# Altium schematic sheet Prom21Core.SchDoc
size 566 x 320 mm; SheetNumber: 3; SheetTotal: 6
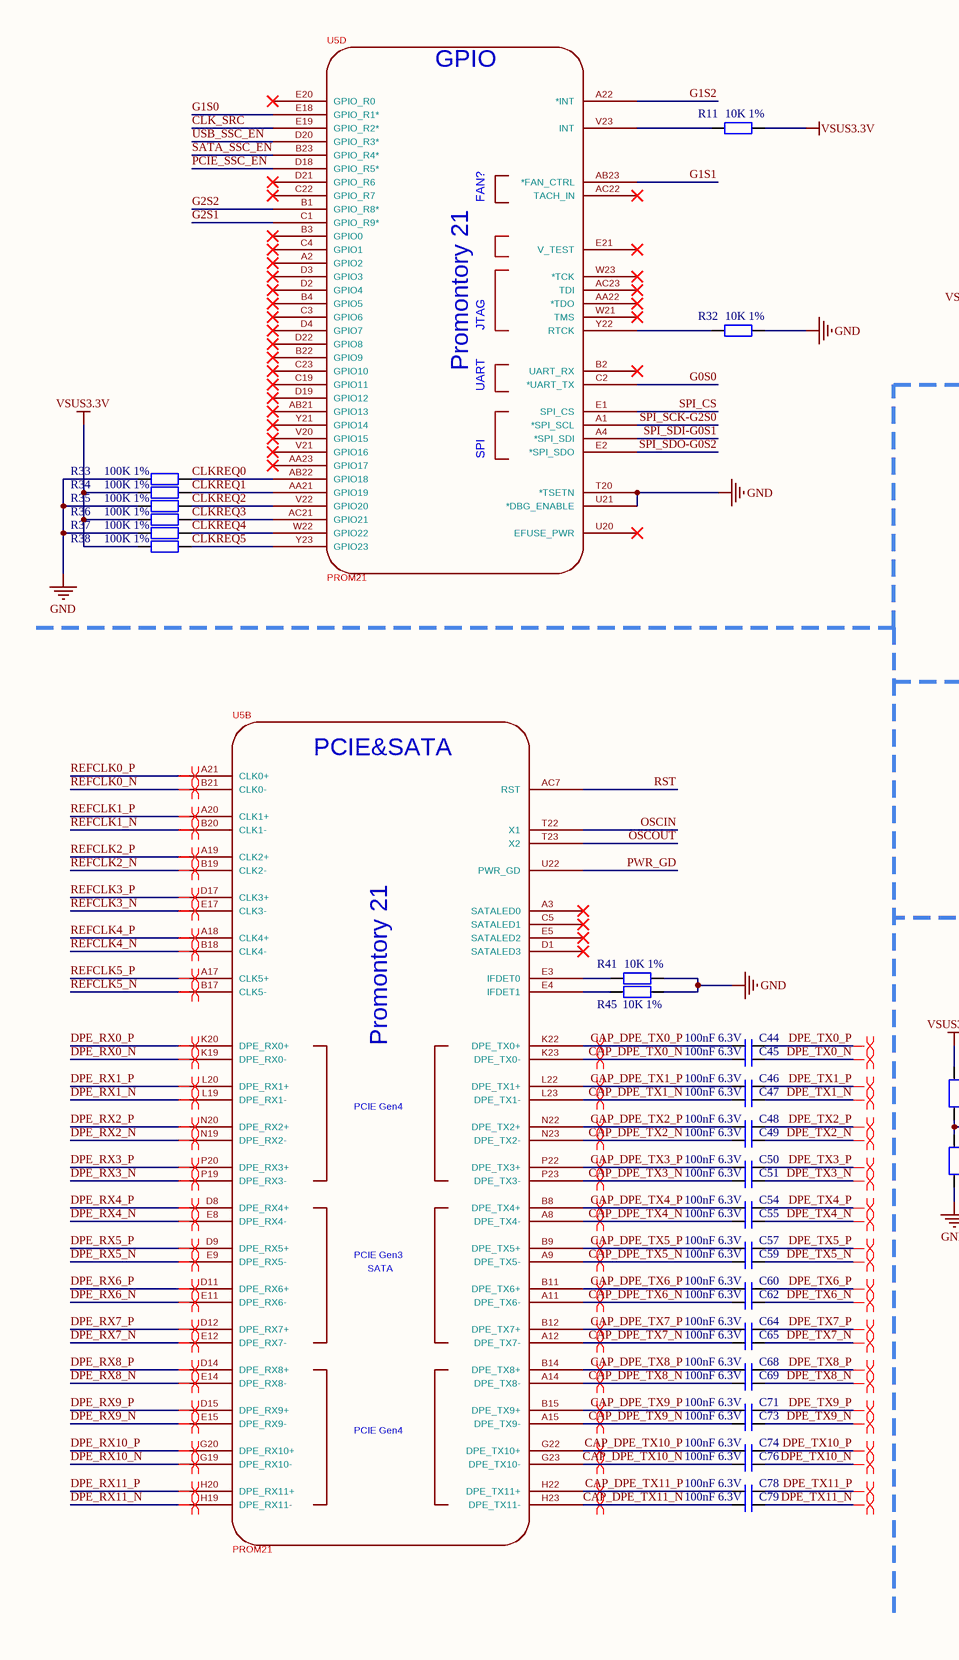
[diagram p0: Prom21Core.SchDoc, left]
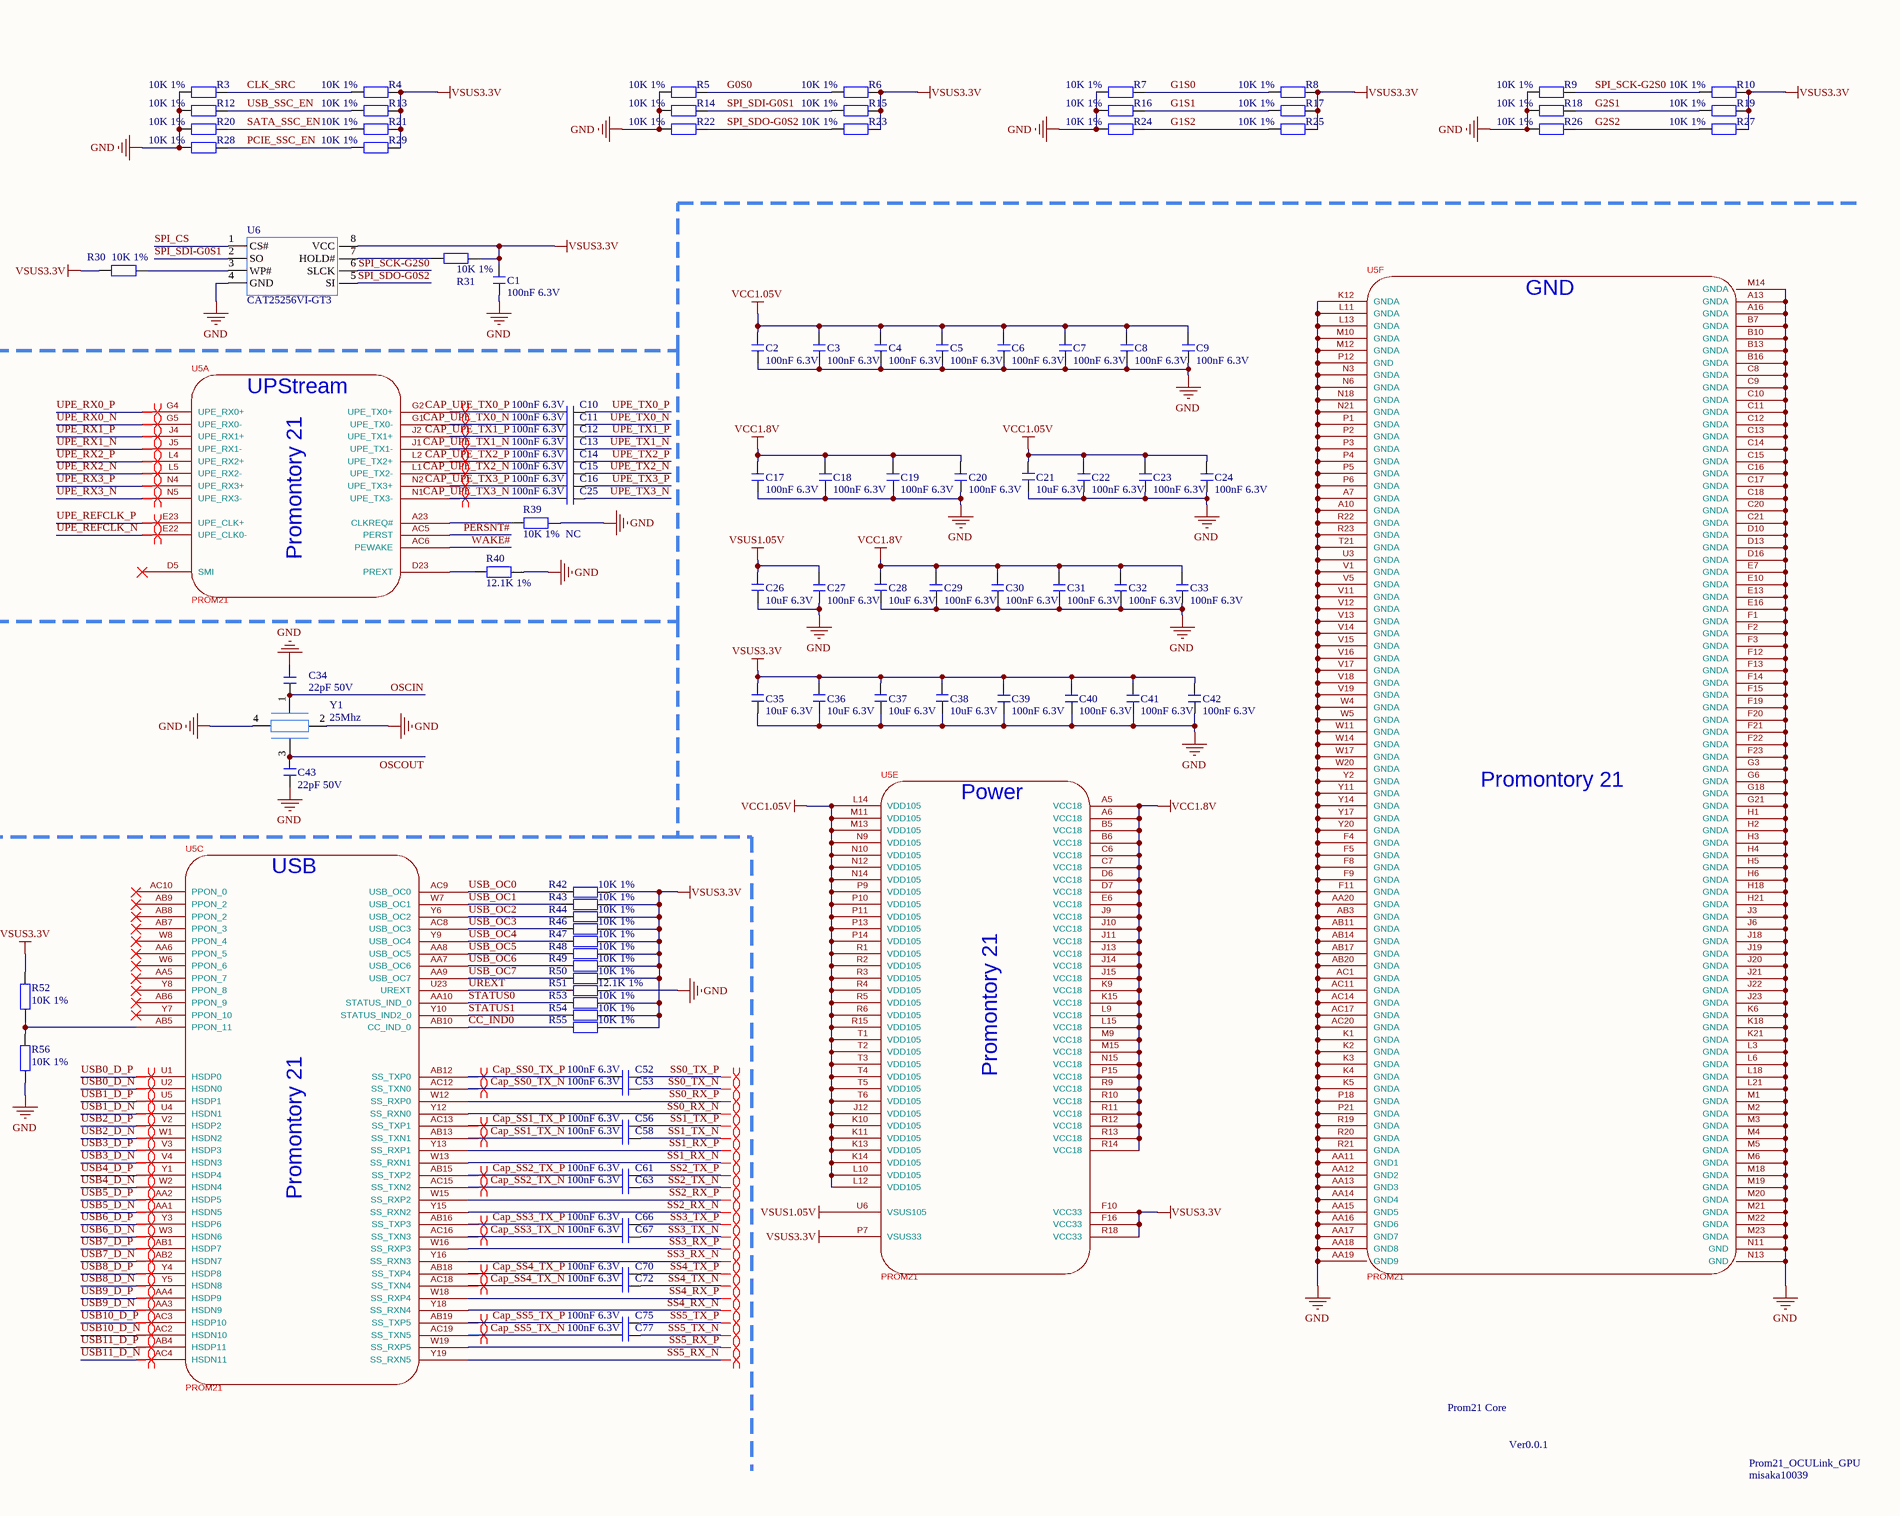
[diagram p1: Prom21Core.SchDoc, right]

## Parts
C1  100nF 6.3V  [C0402_L]
C2  100nF 6.3V  [C0402_L]
C3  100nF 6.3V  [C0402_L]
C4  100nF 6.3V  [C0402_L]
C5  100nF 6.3V  [C0402_L]
C6  100nF 6.3V  [C0402_L]
C7  100nF 6.3V  [C0402_L]
C8  100nF 6.3V  [C0402_L]
C9  100nF 6.3V  [C0402_L]
C10  100nF 6.3V  [C0402_L]
C11  100nF 6.3V  [C0402_L]
C12  100nF 6.3V  [C0402_L]
C13  100nF 6.3V  [C0402_L]
C14  100nF 6.3V  [C0402_L]
C15  100nF 6.3V  [C0402_L]
C16  100nF 6.3V  [C0402_L]
C17  100nF 6.3V  [C0402_L]
C18  100nF 6.3V  [C0402_L]
C19  100nF 6.3V  [C0402_L]
C20  100nF 6.3V  [C0402_L]
C21  10uF 6.3V  [C0603_L]
C22  100nF 6.3V  [C0402_L]
C23  100nF 6.3V  [C0402_L]
C24  100nF 6.3V  [C0402_L]
C25  100nF 6.3V  [C0402_L]
C26  10uF 6.3V  [C0603_L]
C27  100nF 6.3V  [C0402_L]
C28  10uF 6.3V  [C0603_L]
C29  100nF 6.3V  [C0402_L]
C30  100nF 6.3V  [C0402_L]
C31  100nF 6.3V  [C0402_L]
C32  100nF 6.3V  [C0402_L]
C33  100nF 6.3V  [C0402_L]
C34  22pF 50V  [C0402_L]
C35  10uF 6.3V  [C0603_L]
C36  10uF 6.3V  [C0603_L]
C37  10uF 6.3V  [C0603_L]
C38  10uF 6.3V  [C0603_L]
C39  100nF 6.3V  [C0402_L]
C40  100nF 6.3V  [C0402_L]
C41  100nF 6.3V  [C0402_L]
C42  100nF 6.3V  [C0402_L]
C43  22pF 50V  [C0402_L]
C44  100nF 6.3V  [C0402_L]
C45  100nF 6.3V  [C0402_L]
C46  100nF 6.3V  [C0402_L]
C47  100nF 6.3V  [C0402_L]
C48  100nF 6.3V  [C0402_L]
C49  100nF 6.3V  [C0402_L]
C50  100nF 6.3V  [C0402_L]
C51  100nF 6.3V  [C0402_L]
C52  100nF 6.3V  [C0402_L]
C53  100nF 6.3V  [C0402_L]
C54  100nF 6.3V  [C0402_L]
C55  100nF 6.3V  [C0402_L]
C56  100nF 6.3V  [C0402_L]
C57  100nF 6.3V  [C0402_L]
C58  100nF 6.3V  [C0402_L]
C59  100nF 6.3V  [C0402_L]
C60  100nF 6.3V  [C0402_L]
C61  100nF 6.3V  [C0402_L]
C62  100nF 6.3V  [C0402_L]
C63  100nF 6.3V  [C0402_L]
C64  100nF 6.3V  [C0402_L]
C65  100nF 6.3V  [C0402_L]
C66  100nF 6.3V  [C0402_L]
C67  100nF 6.3V  [C0402_L]
C68  100nF 6.3V  [C0402_L]
C69  100nF 6.3V  [C0402_L]
C70  100nF 6.3V  [C0402_L]
C71  100nF 6.3V  [C0402_L]
C72  100nF 6.3V  [C0402_L]
C73  100nF 6.3V  [C0402_L]
C74  100nF 6.3V  [C0402_L]
C75  100nF 6.3V  [C0402_L]
C76  100nF 6.3V  [C0402_L]
C77  100nF 6.3V  [C0402_L]
C78  100nF 6.3V  [C0402_L]
C79  100nF 6.3V  [C0402_L]
R3  10K 1%  [R0402_L]
R4  10K 1%  [R0402_L]
R5  10K 1%  [R0402_L]
R6  10K 1%  [R0402_L]
R7  10K 1%  [R0402_L]
R8  10K 1%  [R0402_L]
R9  10K 1%  [R0402_L]
R10  10K 1%  [R0402_L]
R11  10K 1%  [R0402_L]
R12  10K 1%  [R0402_L]
R13  10K 1%  [R0402_L]
R14  10K 1%  [R0402_L]
R15  10K 1%  [R0402_L]
R16  10K 1%  [R0402_L]
R17  10K 1%  [R0402_L]
R18  10K 1%  [R0402_L]
R19  10K 1%  [R0402_L]
R20  10K 1%  [R0402_L]
R21  10K 1%  [R0402_L]
R22  10K 1%  [R0402_L]
R23  10K 1%  [R0402_L]
R24  10K 1%  [R0402_L]
R25  10K 1%  [R0402_L]
R26  10K 1%  [R0402_L]
R27  10K 1%  [R0402_L]
R28  10K 1%  [R0402_L]
R29  10K 1%  [R0402_L]
R30  10K 1%  [R0402_L]
R31  10K 1%  [R0402_L]
R32  10K 1%  [R0402_L]
R33  100K 1%  [R0402_L]
R34  100K 1%  [R0402_L]
R35  100K 1%  [R0402_L]
R36  100K 1%  [R0402_L]
R37  100K 1%  [R0402_L]
R38  100K 1%  [R0402_L]
R39  10K 1%  NC  [R0402_L]
R40  12.1K 1%  [R0402_L]
R41  10K 1%  [R0402_L]
R42  10K 1%  [R0402_L]
R43  10K 1%  [R0402_L]
R44  10K 1%  [R0402_L]
R45  10K 1%  [R0402_L]
R46  10K 1%  [R0402_L]
R47  10K 1%  [R0402_L]
R48  10K 1%  [R0402_L]
R49  10K 1%  [R0402_L]
R50  10K 1%  [R0402_L]
R51  12.1K 1%  [R0402_L]
R52  10K 1%  [R0402_L]
R53  10K 1%  [R0402_L]
R54  10K 1%  [R0402_L]
R55  10K 1%  [R0402_L]
R56  10K 1%  [R0402_L]
U5  PROM21  [PROM21]  (parts A,B,C,D,E,F of 6)
U6  CAT25256VI-GT3  [SOP8_M]
Y1  25Mhz  [OSC-3225-4P]

## Nets
GND: C1.2 C2.2 C3.2 C4.2 C5.2 C6.2 C7.2 C8.2 C9.2 C17.2 C18.2 C19.2 C20.2 C21.1 C22.2 C23.2 C24.2 C26.1 C27.2 C28.1 C29.2 C30.2 C31.2 C32.2 C33.2 C34.1 C35.1 C36.1 C37.1 C38.1 C39.2 C40.2 C41.2 C42.2 C43.1 R3.1 R5.1 R7.1 R9.1 R12.1 R14.1 R16.1 R18.1 R20.1 R22.1 R24.1 R26.1 R28.1 R32.2 R33.1 R35.1 R37.1 R39.2 R40.2 R41.2 R45.2 R51.1 R56.1 U5.A7(GNDA) U5.A10(GNDA) U5.A13(GNDA) U5.A16(GNDA) U5.AA11(GND1) U5.AA12(GND2) U5.AA13(GND3) U5.AA14(GND4) U5.AA15(GND5) U5.AA16(GND6) U5.AA17(GND7) U5.AA18(GND8) U5.AA19(GND9) U5.AA20(GNDA) U5.AB3(GNDA) U5.AB11(GNDA) U5.AB14(GNDA) U5.AB17(GNDA) U5.AB20(GNDA) U5.AC1(GNDA) U5.AC11(GNDA) U5.AC14(GNDA) U5.AC17(GNDA) U5.AC20(GNDA) U5.B7(GNDA) U5.B10(GNDA) U5.B13(GNDA) U5.B16(GNDA) U5.C8(GNDA) U5.C9(GNDA) U5.C10(GNDA) U5.C11(GNDA) U5.C12(GNDA) U5.C13(GNDA) U5.C14(GNDA) U5.C15(GNDA) U5.C16(GNDA) U5.C17(GNDA) U5.C18(GNDA) U5.C20(GNDA) U5.C21(GNDA) U5.D10(GNDA) U5.D13(GNDA) U5.D16(GNDA) U5.E7(GNDA) U5.E10(GNDA) U5.E13(GNDA) U5.E16(GNDA) U5.F1(GNDA) U5.F2(GNDA) U5.F3(GNDA) U5.F4(GNDA) U5.F5(GNDA) U5.F8(GNDA) U5.F9(GNDA) U5.F11(GNDA) U5.F12(GNDA) U5.F13(GNDA) U5.F14(GNDA) U5.F15(GNDA) U5.F19(GNDA) U5.F20(GNDA) U5.F21(GNDA) U5.F22(GNDA) U5.F23(GNDA) U5.G3(GNDA) U5.G6(GNDA) U5.G18(GNDA) U5.G21(GNDA) U5.H1(GNDA) U5.H2(GNDA) U5.H3(GNDA) U5.H4(GNDA) U5.H5(GNDA) U5.H6(GNDA) U5.H18(GNDA) U5.H21(GNDA) U5.J3(GNDA) U5.J6(GNDA) U5.J18(GNDA) U5.J19(GNDA) U5.J20(GNDA) U5.J21(GNDA) U5.J22(GNDA) U5.J23(GNDA) U5.K1(GNDA) U5.K2(GNDA) U5.K3(GNDA) U5.K4(GNDA) U5.K5(GNDA) U5.K6(GNDA) U5.K12(GNDA) U5.K18(GNDA) U5.K21(GNDA) U5.L3(GNDA) U5.L6(GNDA) U5.L11(GNDA) U5.L13(GNDA) U5.L18(GNDA) U5.L21(GNDA) U5.M1(GNDA) U5.M2(GNDA) U5.M3(GNDA) U5.M4(GNDA) U5.M5(GNDA) U5.M6(GNDA) U5.M10(GNDA) U5.M12(GNDA) U5.M14(GNDA) U5.M18(GNDA) U5.M19(GNDA) U5.M20(GNDA) U5.M21(GNDA) U5.M22(GNDA) U5.M23(GNDA) U5.N3(GNDA) U5.N6(GNDA) U5.N11(GND) U5.N13(GND) U5.N18(GNDA) U5.N21(GNDA) U5.P1(GNDA) U5.P2(GNDA) U5.P3(GNDA) U5.P4(GNDA) U5.P5(GNDA) U5.P6(GNDA) U5.P12(GND) U5.P18(GNDA) U5.P21(GNDA) U5.R19(GNDA) U5.R20(GNDA) U5.R21(GNDA) U5.R22(GNDA) U5.R23(GNDA) U5.T20(*TSETN) U5.T21(GNDA) U5.U3(GNDA) U5.U21(*DBG_ENABLE) U5.V1(GNDA) U5.V5(GNDA) U5.V11(GNDA) U5.V12(GNDA) U5.V13(GNDA) U5.V14(GNDA) U5.V15(GNDA) U5.V16(GNDA) U5.V17(GNDA) U5.V18(GNDA) U5.V19(GNDA) U5.W4(GNDA) U5.W5(GNDA) U5.W11(GNDA) U5.W14(GNDA) U5.W17(GNDA) U5.W20(GNDA) U5.Y2(GNDA) U5.Y11(GNDA) U5.Y14(GNDA) U5.Y17(GNDA) U5.Y20(GNDA) U6.4(GND) Y1.2(GND) Y1.4(GND)
VCC1.05V: C2.1 C3.1 C4.1 C5.1 C6.1 C7.1 C8.1 C9.1 C21.2 C22.1 C23.1 C24.1 U5.J12(VDD105) U5.K10(VDD105) U5.K11(VDD105) U5.K13(VDD105) U5.K14(VDD105) U5.L10(VDD105) U5.L12(VDD105) U5.L14(VDD105) U5.M11(VDD105) U5.M13(VDD105) U5.N9(VDD105) U5.N10(VDD105) U5.N12(VDD105) U5.N14(VDD105) U5.P9(VDD105) U5.P10(VDD105) U5.P11(VDD105) U5.P13(VDD105) U5.P14(VDD105) U5.R1(VDD105) U5.R2(VDD105) U5.R3(VDD105) U5.R4(VDD105) U5.R5(VDD105) U5.R6(VDD105) U5.R15(VDD105) U5.T1(VDD105) U5.T2(VDD105) U5.T3(VDD105) U5.T4(VDD105) U5.T5(VDD105) U5.T6(VDD105)
VCC1.8V: C17.1 C18.1 C19.1 C20.1 C28.2 C29.1 C30.1 C31.1 C32.1 C33.1 U5.A5(VCC18) U5.A6(VCC18) U5.B5(VCC18) U5.B6(VCC18) U5.C6(VCC18) U5.C7(VCC18) U5.D6(VCC18) U5.D7(VCC18) U5.E6(VCC18) U5.J9(VCC18) U5.J10(VCC18) U5.J11(VCC18) U5.J13(VCC18) U5.J14(VCC18) U5.J15(VCC18) U5.K9(VCC18) U5.K15(VCC18) U5.L9(VCC18) U5.L15(VCC18) U5.M9(VCC18) U5.M15(VCC18) U5.N15(VCC18) U5.P15(VCC18) U5.R9(VCC18) U5.R10(VCC18) U5.R11(VCC18) U5.R12(VCC18) U5.R13(VCC18) U5.R14(VCC18)
VSUS1.05V: C26.2 C27.1 U5.U6(VSUS105)
VSUS3.3V: C1.1 C35.2 C36.2 C37.2 C38.2 C39.1 C40.1 C41.1 C42.1 R4.2 R6.2 R8.2 R10.2 R11.2 R13.2 R15.2 R17.2 R19.2 R21.2 R23.2 R25.2 R27.2 R29.2 R30.1 R31.2 R34.1 R36.1 R38.1 R42.1 R43.1 R44.1 R46.1 R47.1 R48.1 R49.1 R50.1 R52.2 R53.1 R54.1 R55.1 U5.F10(VCC33) U5.F16(VCC33) U5.P7(VSUS33) U5.R18(VCC33) U6.8(VCC)
CAP_DPE_TX0_N: C45.2 U5.K23(DPE_TX0-)
CAP_DPE_TX0_P: C44.2 U5.K22(DPE_TX0+)
CAP_DPE_TX1_N: C47.2 U5.L23(DPE_TX1-)
CAP_DPE_TX1_P: C46.2 U5.L22(DPE_TX1+)
CAP_DPE_TX2_N: C49.2 U5.N23(DPE_TX2-)
CAP_DPE_TX2_P: C48.2 U5.N22(DPE_TX2+)
CAP_DPE_TX3_N: C51.2 U5.P23(DPE_TX3-)
CAP_DPE_TX3_P: C50.2 U5.P22(DPE_TX3+)
CAP_DPE_TX4_N: C55.2 U5.A8(DPE_TX4-)
CAP_DPE_TX4_P: C54.2 U5.B8(DPE_TX4+)
CAP_DPE_TX5_N: C59.2 U5.A9(DPE_TX5-)
CAP_DPE_TX5_P: C57.2 U5.B9(DPE_TX5+)
CAP_DPE_TX6_N: C62.2 U5.A11(DPE_TX6-)
CAP_DPE_TX6_P: C60.2 U5.B11(DPE_TX6+)
CAP_DPE_TX7_N: C65.2 U5.A12(DPE_TX7-)
CAP_DPE_TX7_P: C64.2 U5.B12(DPE_TX7+)
CAP_DPE_TX8_N: C69.2 U5.A14(DPE_TX8-)
CAP_DPE_TX8_P: C68.2 U5.B14(DPE_TX8+)
CAP_DPE_TX9_N: C73.2 U5.A15(DPE_TX9-)
CAP_DPE_TX9_P: C71.2 U5.B15(DPE_TX9+)
CAP_DPE_TX10_N: C76.2 U5.G23(DPE_TX10-)
CAP_DPE_TX10_P: C74.2 U5.G22(DPE_TX10+)
CAP_DPE_TX11_N: C79.2 U5.H23(DPE_TX11-)
CAP_DPE_TX11_P: C78.2 U5.H22(DPE_TX11+)
Cap_SS0_TX_N: C53.2 U5.AC12(SS_TXN0)
Cap_SS0_TX_P: C52.2 U5.AB12(SS_TXP0)
Cap_SS1_TX_N: C58.2 U5.AB13(SS_TXN1)
Cap_SS1_TX_P: C56.2 U5.AC13(SS_TXP1)
Cap_SS2_TX_N: C63.2 U5.AC15(SS_TXN2)
Cap_SS2_TX_P: C61.2 U5.AB15(SS_TXP2)
Cap_SS3_TX_N: C67.2 U5.AC16(SS_TXN3)
Cap_SS3_TX_P: C66.2 U5.AB16(SS_TXP3)
Cap_SS4_TX_N: C72.2 U5.AC18(SS_TXN4)
Cap_SS4_TX_P: C70.2 U5.AB18(SS_TXP4)
Cap_SS5_TX_N: C77.2 U5.AC19(SS_TXN5)
Cap_SS5_TX_P: C75.2 U5.AB19(SS_TXP5)
CAP_UPE_TX0_N: C11.2 U5.G1(UPE_TX0-)
CAP_UPE_TX0_P: C10.2 U5.G2(UPE_TX0+)
CAP_UPE_TX1_N: C13.2 U5.J1(UPE_TX1-)
CAP_UPE_TX1_P: C12.2 U5.J2(UPE_TX1+)
CAP_UPE_TX2_N: C15.2 U5.L1(UPE_TX2-)
CAP_UPE_TX2_P: C14.2 U5.L2(UPE_TX2+)
CAP_UPE_TX3_N: C25.2 U5.N1(UPE_TX3-)
CAP_UPE_TX3_P: C16.2 U5.N2(UPE_TX3+)
CC_IND0: R55.2 U5.AB10(CC_IND_0)
CLK_SRC: R3.2 R4.1 U5.E19(GPIO_R2*)
CLKREQ0: R33.2 U5.AB22(GPIO18)
CLKREQ1: R34.2 U5.AA21(GPIO19)
CLKREQ2: R35.2 U5.V22(GPIO20)
CLKREQ3: R36.2 U5.AC21(GPIO21)
CLKREQ4: R37.2 U5.W22(GPIO22)
CLKREQ5: R38.2 U5.Y23(GPIO23)
DPE_RX0_N: U5.K19(DPE_RX0-)
DPE_RX0_P: U5.K20(DPE_RX0+)
DPE_RX1_N: U5.L19(DPE_RX1-)
DPE_RX1_P: U5.L20(DPE_RX1+)
DPE_RX2_N: U5.N19(DPE_RX2-)
DPE_RX2_P: U5.N20(DPE_RX2+)
DPE_RX3_N: U5.P19(DPE_RX3-)
DPE_RX3_P: U5.P20(DPE_RX3+)
DPE_RX4_N: U5.E8(DPE_RX4-)
DPE_RX4_P: U5.D8(DPE_RX4+)
DPE_RX5_N: U5.E9(DPE_RX5-)
DPE_RX5_P: U5.D9(DPE_RX5+)
DPE_RX6_N: U5.E11(DPE_RX6-)
DPE_RX6_P: U5.D11(DPE_RX6+)
DPE_RX7_N: U5.E12(DPE_RX7-)
DPE_RX7_P: U5.D12(DPE_RX7+)
DPE_RX8_N: U5.E14(DPE_RX8-)
DPE_RX8_P: U5.D14(DPE_RX8+)
DPE_RX9_N: U5.E15(DPE_RX9-)
DPE_RX9_P: U5.D15(DPE_RX9+)
DPE_RX10_N: U5.G19(DPE_RX10-)
DPE_RX10_P: U5.G20(DPE_RX10+)
DPE_RX11_N: U5.H19(DPE_RX11-)
DPE_RX11_P: U5.H20(DPE_RX11+)
DPE_TX0_N: C45.1
DPE_TX0_P: C44.1
DPE_TX1_N: C47.1
DPE_TX1_P: C46.1
DPE_TX2_N: C49.1
DPE_TX2_P: C48.1
DPE_TX3_N: C51.1
DPE_TX3_P: C50.1
DPE_TX4_N: C55.1
DPE_TX4_P: C54.1
DPE_TX5_N: C59.1
DPE_TX5_P: C57.1
DPE_TX6_N: C62.1
DPE_TX6_P: C60.1
DPE_TX7_N: C65.1
DPE_TX7_P: C64.1
DPE_TX8_N: C69.1
DPE_TX8_P: C68.1
DPE_TX9_N: C73.1
DPE_TX9_P: C71.1
DPE_TX10_N: C76.1
DPE_TX10_P: C74.1
DPE_TX11_N: C79.1
DPE_TX11_P: C78.1
G0S0: R5.2 R6.1 U5.C2(*UART_TX)
G1S0: R7.2 R8.1 U5.E18(GPIO_R1*)
G1S1: R16.2 R17.1 U5.AB23(*FAN_CTRL)
G1S2: R24.2 R25.1 U5.A22(*INT)
G2S1: R18.2 R19.1 U5.C1(GPIO_R9*)
G2S2: R26.2 R27.1 U5.B1(GPIO_R8*)
OSCIN: C34.2 U5.T22(X1) Y1.1(XTAL_N)
OSCOUT: C43.2 U5.T23(X2) Y1.3(XTAL_P)
PCIE_SSC_EN: R28.2 R29.1 U5.D18(GPIO_R5*)
PERSNT#: U5.AC5(PERST)
PWR_GD: U5.U22(PWR_GD)
REFCLK0_N: U5.B21(CLK0-)
REFCLK0_P: U5.A21(CLK0+)
REFCLK1_N: U5.B20(CLK1-)
REFCLK1_P: U5.A20(CLK1+)
REFCLK2_N: U5.B19(CLK2-)
REFCLK2_P: U5.A19(CLK2+)
REFCLK3_N: U5.E17(CLK3-)
REFCLK3_P: U5.D17(CLK3+)
REFCLK4_N: U5.B18(CLK4-)
REFCLK4_P: U5.A18(CLK4+)
REFCLK5_N: U5.B17(CLK5-)
REFCLK5_P: U5.A17(CLK5+)
RST: U5.AC7(RST)
SATA_SSC_EN: R20.2 R21.1 U5.B23(GPIO_R4*)
SPI_CS: U5.E1(SPI_CS) U6.1(CS#)
SPI_SCK-G2S0: R9.2 R10.1 U5.A1(*SPI_SCL) U6.6(SLCK)
SPI_SDI-G0S1: R14.2 R15.1 U5.A4(*SPI_SDI) U6.2(SO)
SPI_SDO-G0S2: R22.2 R23.1 U5.E2(*SPI_SDO) U6.5(SI)
SS0_RX_N: U5.Y12(SS_RXN0)
SS0_RX_P: U5.W12(SS_RXP0)
SS0_TX_N: C53.1
SS0_TX_P: C52.1
SS1_RX_N: U5.W13(SS_RXN1)
SS1_RX_P: U5.Y13(SS_RXP1)
SS1_TX_N: C58.1
SS1_TX_P: C56.1
SS2_RX_N: U5.Y15(SS_RXN2)
SS2_RX_P: U5.W15(SS_RXP2)
SS2_TX_N: C63.1
SS2_TX_P: C61.1
SS3_RX_N: U5.Y16(SS_RXN3)
SS3_RX_P: U5.W16(SS_RXP3)
SS3_TX_N: C67.1
SS3_TX_P: C66.1
SS4_RX_N: U5.Y18(SS_RXN4)
SS4_RX_P: U5.W18(SS_RXP4)
SS4_TX_N: C72.1
SS4_TX_P: C70.1
SS5_RX_N: U5.Y19(SS_RXN5)
SS5_RX_P: U5.W19(SS_RXP5)
SS5_TX_N: C77.1
SS5_TX_P: C75.1
STATUS0: R53.2 U5.AA10(STATUS_IND_0)
STATUS1: R54.2 U5.Y10(STATUS_IND2_0)
UPE_REFCLK_N: U5.E22(UPE_CLK0-)
UPE_REFCLK_P: U5.E23(UPE_CLK+)
UPE_RX0_N: U5.G5(UPE_RX0-)
UPE_RX0_P: U5.G4(UPE_RX0+)
UPE_RX1_N: U5.J5(UPE_RX1-)
UPE_RX1_P: U5.J4(UPE_RX1+)
UPE_RX2_N: U5.L5(UPE_RX2-)
UPE_RX2_P: U5.L4(UPE_RX2+)
UPE_RX3_N: U5.N5(UPE_RX3-)
UPE_RX3_P: U5.N4(UPE_RX3+)
UPE_TX0_N: C11.1
UPE_TX0_P: C10.1
UPE_TX1_N: C13.1
UPE_TX1_P: C12.1
UPE_TX2_N: C15.1
UPE_TX2_P: C14.1
UPE_TX3_N: C25.1
UPE_TX3_P: C16.1
UREXT: R51.2 U5.U23(UREXT)
USB0_D_N: U5.U2(HSDN0)
USB0_D_P: U5.U1(HSDP0)
USB1_D_N: U5.U4(HSDN1)
USB1_D_P: U5.U5(HSDP1)
USB2_D_N: U5.W1(HSDN2)
USB2_D_P: U5.V2(HSDP2)
USB3_D_N: U5.V4(HSDN3)
USB3_D_P: U5.V3(HSDP3)
USB4_D_N: U5.W2(HSDN4)
USB4_D_P: U5.Y1(HSDP4)
USB5_D_N: U5.AA1(HSDN5)
USB5_D_P: U5.AA2(HSDP5)
USB6_D_N: U5.W3(HSDN6)
USB6_D_P: U5.Y3(HSDP6)
USB7_D_N: U5.AB2(HSDN7)
USB7_D_P: U5.AB1(HSDP7)
USB8_D_N: U5.Y5(HSDN8)
USB8_D_P: U5.Y4(HSDP8)
USB9_D_N: U5.AA3(HSDN9)
USB9_D_P: U5.AA4(HSDP9)
USB10_D_N: U5.AC2(HSDN10)
USB10_D_P: U5.AC3(HSDP10)
USB11_D_N: U5.AC4(HSDN11)
USB11_D_P: U5.AB4(HSDP11)
USB_OC0: R42.2 U5.AC9(USB_OC0)
USB_OC1: R43.2 U5.W7(USB_OC1)
USB_OC2: R44.2 U5.Y6(USB_OC2)
USB_OC3: R46.2 U5.AC8(USB_OC3)
USB_OC4: R47.2 U5.Y9(USB_OC4)
USB_OC5: R48.2 U5.AA8(USB_OC5)
USB_OC6: R49.2 U5.AA7(USB_OC6)
USB_OC7: R50.2 U5.AA9(USB_OC7)
USB_SSC_EN: R12.2 R13.1 U5.D20(GPIO_R3*)
WAKE#: U5.AC6(PEWAKE)
NetR11_1: R11.1 U5.V23(INT)
NetR30_2: R30.2 U6.3(WP#)
NetR31_1: R31.1 U6.7(HOLD#)
NetR32_1: R32.1 U5.Y22(RTCK)
NetR39_1: R39.1 U5.A23(CLKREQ#)
NetR40_1: R40.1 U5.D23(PREXT)
NetR41_1: R41.1 U5.E3(IFDET0)
NetR45_1: R45.1 U5.E4(IFDET1)
NetR52_1: R52.1 R56.2 U5.AB5(PPON_11)

Not connected (* = marked no-connect by the designer): U5 A2(GPIO2)* A3(SATALED0)* AA5(PPON_7)* AA6(PPON_5)* AA22(*TDO)* AA23(GPIO17)* AB6(PPON_9)* AB7(PPON_3)* AB8(PPON_2)* AB9(PPON_2)* AB21(GPIO13)* AC10(PPON_0)* AC22(TACH_IN)* AC23(TDI)* B2(UART_RX)* B3(GPIO0)* B4(GPIO5)* B22(GPIO9)* C3(GPIO6)* C4(GPIO1)* C5(SATALED1)* C19(GPIO11)* C22(GPIO_R7)* C23(GPIO10)* D1(SATALED3)* D2(GPIO4)* D3(GPIO3)* D4(GPIO7)* D5(SMI)* D19(GPIO12)* D21(GPIO_R6)* D22(GPIO8)* E5(SATALED2)* E20(GPIO_R0)* E21(V_TEST)* U20(EFUSE_PWR)* V20(GPIO15)* V21(GPIO16)* W6(PPON_6)* W8(PPON_4)* W21(TMS)* W23(*TCK)* Y7(PPON_10)* Y8(PPON_8)* Y21(GPIO14)*

## Layout directives
differential pair: CAP_DPE_TX0_N, CAP_DPE_TX0_P, CAP_DPE_TX1_N, CAP_DPE_TX1_P, CAP_DPE_TX2_N, CAP_DPE_TX2_P, CAP_DPE_TX3_N, CAP_DPE_TX3_P, CAP_DPE_TX4_N, CAP_DPE_TX4_P, CAP_DPE_TX5_N, CAP_DPE_TX5_P, CAP_DPE_TX6_N, CAP_DPE_TX6_P, CAP_DPE_TX7_N, CAP_DPE_TX7_P, CAP_DPE_TX8_N, CAP_DPE_TX8_P, CAP_DPE_TX9_N, CAP_DPE_TX9_P, CAP_DPE_TX10_N, CAP_DPE_TX10_P, CAP_DPE_TX11_N, CAP_DPE_TX11_P, Cap_SS0_TX_N, Cap_SS0_TX_P, Cap_SS1_TX_N, Cap_SS1_TX_P, Cap_SS2_TX_N, Cap_SS2_TX_P, Cap_SS3_TX_N, Cap_SS3_TX_P, Cap_SS4_TX_N, Cap_SS4_TX_P, Cap_SS5_TX_N, Cap_SS5_TX_P, CAP_UPE_TX0_N, CAP_UPE_TX0_P, CAP_UPE_TX1_N, CAP_UPE_TX1_P, CAP_UPE_TX2_N, CAP_UPE_TX2_P, CAP_UPE_TX3_N, CAP_UPE_TX3_P, DPE_RX0_N, DPE_RX0_P, DPE_RX1_N, DPE_RX1_P, DPE_RX2_N, DPE_RX2_P, DPE_RX3_N, DPE_RX3_P, DPE_RX4_N, DPE_RX4_P, DPE_RX5_N, DPE_RX5_P, DPE_RX6_N, DPE_RX6_P, DPE_RX7_N, DPE_RX7_P, DPE_RX8_N, DPE_RX8_P, DPE_RX9_N, DPE_RX9_P, DPE_RX10_N, DPE_RX10_P, DPE_RX11_N, DPE_RX11_P, DPE_TX0_N, DPE_TX0_P, DPE_TX1_N, DPE_TX1_P, DPE_TX2_N, DPE_TX2_P, DPE_TX3_N, DPE_TX3_P, DPE_TX4_N, DPE_TX4_P, DPE_TX5_N, DPE_TX5_P, DPE_TX6_N, DPE_TX6_P, DPE_TX7_N, DPE_TX7_P, DPE_TX8_N, DPE_TX8_P, DPE_TX9_N, DPE_TX9_P, DPE_TX10_N, DPE_TX10_P, DPE_TX11_N, DPE_TX11_P, REFCLK0_N, REFCLK0_P, REFCLK1_N, REFCLK1_P, REFCLK2_N, REFCLK2_P, REFCLK3_N, REFCLK3_P, REFCLK4_N, REFCLK4_P, REFCLK5_N, REFCLK5_P, SS0_RX_N, SS0_RX_P, SS0_TX_N, SS0_TX_P, SS1_RX_N, SS1_RX_P, SS1_TX_N, SS1_TX_P, SS2_RX_N, SS2_RX_P, SS2_TX_N, SS2_TX_P, SS3_RX_N, SS3_RX_P, SS3_TX_N, SS3_TX_P, SS4_RX_N, SS4_RX_P, SS4_TX_N, SS4_TX_P, SS5_RX_N, SS5_RX_P, SS5_TX_N, SS5_TX_P, UPE_REFCLK_N, UPE_REFCLK_P, UPE_RX0_N, UPE_RX0_P, UPE_RX1_N, UPE_RX1_P, UPE_RX2_N, UPE_RX2_P, UPE_RX3_N, UPE_RX3_P, USB0_D_N, USB0_D_P, USB1_D_N, USB1_D_P, USB2_D_N, USB2_D_P, USB3_D_N, USB3_D_P, USB4_D_N, USB4_D_P, USB5_D_N, USB5_D_P, USB6_D_N, USB6_D_P, USB7_D_N, USB7_D_P, USB8_D_N, USB8_D_P, USB9_D_N, USB9_D_P, USB10_D_N, USB10_D_P, USB11_D_N, USB11_D_P

## Notes on the sheet
- Prom21 Core
- Ver0.0.1
- Prom21_OCULink_GPU
- misaka10039
- (in symbol PROM21, part A) UPStream; Promontory 21
- (in symbol PROM21, part B) PCIE&SATA; Promontory 21; PCIE Gen4; PCIE Gen3; SATA
- (in symbol PROM21, part C) USB; Promontory 21
- (in symbol PROM21, part D) GPIO; FAN?; JTAG; Promontory 21; UART; SPI
- (in symbol PROM21, part E) Power; Promontory 21
- (in symbol PROM21, part F) Promontory 21

## Library data of the parts
C1-C79 = C: 无极性贴片电容; 版权归属: 源创客; 材质: X7R; BOM名称: 无极性贴片电容; 学习资源: www.ooocke.com
R3-R56 = R: 贴片电阻; 版权归属: 源创客; BOM名称: 贴片电阻; 学习资源: www.ooocke.com
U5 = PROM21: AMD B650; Relevance: []; AddInBom: yes; Device: PROM21; ConvertToPcb: yes; SymbolName: PROM21; FootprintName: PROM21
U6 = P25D40H
Y1 = Crystal